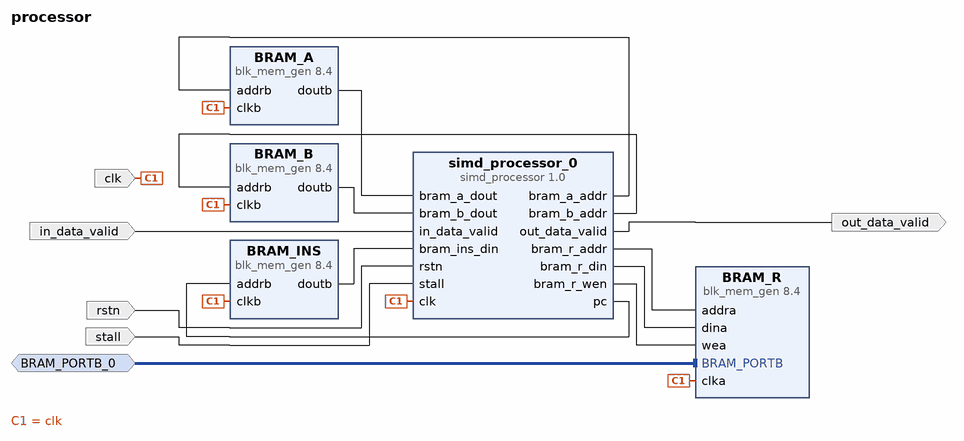
[diagram p0: block diagram of the top level]
# Vivado block design processor, xc7z020clg484-1, Vivado 2023.1
create_bd_design processor

create_bd_intf_port -mode Slave -vlnv xilinx.com:interface:bram_rtl:1.0 BRAM_PORTB_0
set_property -dict {CONFIG.READ_WRITE_MODE READ_ONLY} [get_bd_intf_ports BRAM_PORTB_0]
create_bd_port -dir I -type clk clk
create_bd_port -dir I -type rst rstn
create_bd_port -dir I stall
create_bd_port -dir I in_data_valid
create_bd_port -dir O out_data_valid

create_bd_cell -type ip -vlnv xilinx.com:ip:blk_mem_gen:8.4 BRAM_A
set_property -dict [list \
  CONFIG.Coe_File ../../../../../../../meminit/a_data.coe \
  CONFIG.Enable_B Always_Enabled \
  CONFIG.Fill_Remaining_Memory_Locations true \
  CONFIG.Load_Init_File true \
  CONFIG.Memory_Type Simple_Dual_Port_RAM \
  CONFIG.Write_Depth_A 2048 \
  CONFIG.Write_Width_A 128 \
  CONFIG.use_bram_block Stand_Alone \
] [get_bd_cells BRAM_A]
create_bd_cell -type ip -vlnv xilinx.com:ip:blk_mem_gen:8.4 BRAM_B
set_property -dict [list \
  CONFIG.Coe_File ../../../../../../../meminit/b_data.coe \
  CONFIG.Enable_B Always_Enabled \
  CONFIG.Fill_Remaining_Memory_Locations true \
  CONFIG.Load_Init_File true \
  CONFIG.Memory_Type Simple_Dual_Port_RAM \
  CONFIG.Write_Depth_A 2048 \
  CONFIG.Write_Width_A 128 \
  CONFIG.use_bram_block Stand_Alone \
] [get_bd_cells BRAM_B]
create_bd_cell -type ip -vlnv xilinx.com:ip:blk_mem_gen:8.4 BRAM_R
set_property -dict [list \
  CONFIG.Enable_A Always_Enabled \
  CONFIG.Enable_B Always_Enabled \
  CONFIG.Fill_Remaining_Memory_Locations true \
  CONFIG.Load_Init_File false \
  CONFIG.Memory_Type Simple_Dual_Port_RAM \
  CONFIG.Write_Depth_A 2048 \
  CONFIG.Write_Width_A 128 \
  CONFIG.use_bram_block Stand_Alone \
] [get_bd_cells BRAM_R]
create_bd_cell -type ip -vlnv xilinx.com:ip:blk_mem_gen:8.4 BRAM_INS
set_property -dict [list \
  CONFIG.Coe_File ../../../../../../../meminit/instructions_1.coe \
  CONFIG.Enable_B Always_Enabled \
  CONFIG.Fill_Remaining_Memory_Locations true \
  CONFIG.Load_Init_File true \
  CONFIG.Memory_Type Simple_Dual_Port_RAM \
  CONFIG.Write_Depth_A 2048 \
  CONFIG.Write_Width_A 64 \
  CONFIG.use_bram_block Stand_Alone \
] [get_bd_cells BRAM_INS]
create_bd_cell -type ip -vlnv xilinx.com:user:simd_processor:1.0 simd_processor_0
set_property -dict {CONFIG.BRAM_DEPTH 2048 CONFIG.INS_ADDR_WIDTH 11} [get_bd_cells simd_processor_0]

# ---- connections ----

connect_bd_intf_net -intf_net BRAM_PORTB_0_1 [get_bd_intf_ports BRAM_PORTB_0] [get_bd_intf_pins BRAM_R/BRAM_PORTB]
connect_bd_net [get_bd_pins BRAM_A/doutb] [get_bd_pins simd_processor_0/bram_a_dout]
connect_bd_net [get_bd_pins BRAM_B/doutb] [get_bd_pins simd_processor_0/bram_b_dout]
connect_bd_net [get_bd_pins BRAM_INS/doutb] [get_bd_pins simd_processor_0/bram_ins_din]
connect_bd_net [get_bd_ports clk] \
  [get_bd_pins BRAM_A/clkb] [get_bd_pins BRAM_B/clkb] [get_bd_pins BRAM_R/clka] [get_bd_pins BRAM_INS/clkb] \
  [get_bd_pins simd_processor_0/clk]
connect_bd_net -net in_data_valid_0_1 [get_bd_ports in_data_valid] [get_bd_pins simd_processor_0/in_data_valid]
connect_bd_net -net rstn_0_1 [get_bd_ports rstn] [get_bd_pins simd_processor_0/rstn]
connect_bd_net [get_bd_pins simd_processor_0/bram_a_addr] [get_bd_pins BRAM_A/addrb]
connect_bd_net [get_bd_pins simd_processor_0/bram_b_addr] [get_bd_pins BRAM_B/addrb]
connect_bd_net [get_bd_pins simd_processor_0/bram_r_addr] [get_bd_pins BRAM_R/addra]
connect_bd_net [get_bd_pins simd_processor_0/bram_r_din] [get_bd_pins BRAM_R/dina]
connect_bd_net [get_bd_pins simd_processor_0/bram_r_wen] [get_bd_pins BRAM_R/wea]
connect_bd_net [get_bd_pins simd_processor_0/out_data_valid] [get_bd_ports out_data_valid]
connect_bd_net [get_bd_pins simd_processor_0/pc] [get_bd_pins BRAM_INS/addrb]
connect_bd_net -net stall_0_1 [get_bd_ports stall] [get_bd_pins simd_processor_0/stall]

validate_bd_design
save_bd_design
